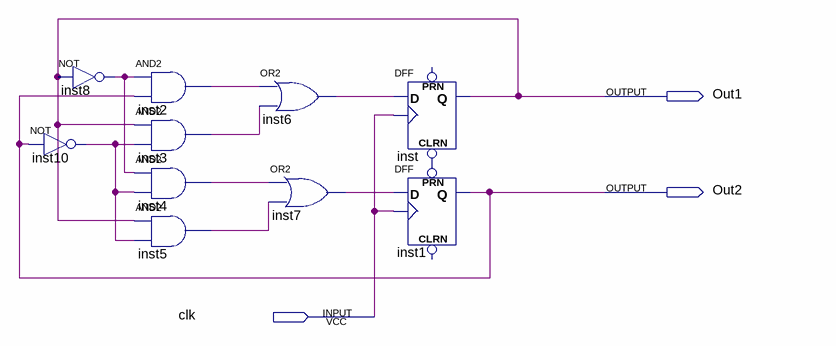
[diagram p0: schematic sheet]
// Quartus schematic Dff_circuit.bdf as structural Verilog: 10 symbols, 3 pins
module Dff_circuit (
  input  clk,
  output Out1,
  output Out2
);

  wire inst2_out, inst3_out, inst4_out, inst5_out, inst6_out, inst7_out, inst8_out, inst10_out, undriven;

  not inst8 (inst8_out, Out1);
  not inst10 (inst10_out, Out2);
  and inst2 (inst2_out, inst8_out, Out2);
  and inst3 (inst3_out, Out1, inst10_out);
  and inst4 (inst4_out, inst8_out, inst10_out);
  and inst5 (inst5_out, Out1, inst10_out);
  or inst6 (inst6_out, inst2_out, inst3_out);
  or inst7 (inst7_out, inst4_out, inst5_out);
  DFF inst (.CLRN(undriven), .CLK(clk), .D(inst6_out), .Q(Out1));  // open: PRN
  DFF inst1 (.CLK(clk), .D(inst7_out), .PRN(undriven), .Q(Out2));  // open: CLRN
endmodule
